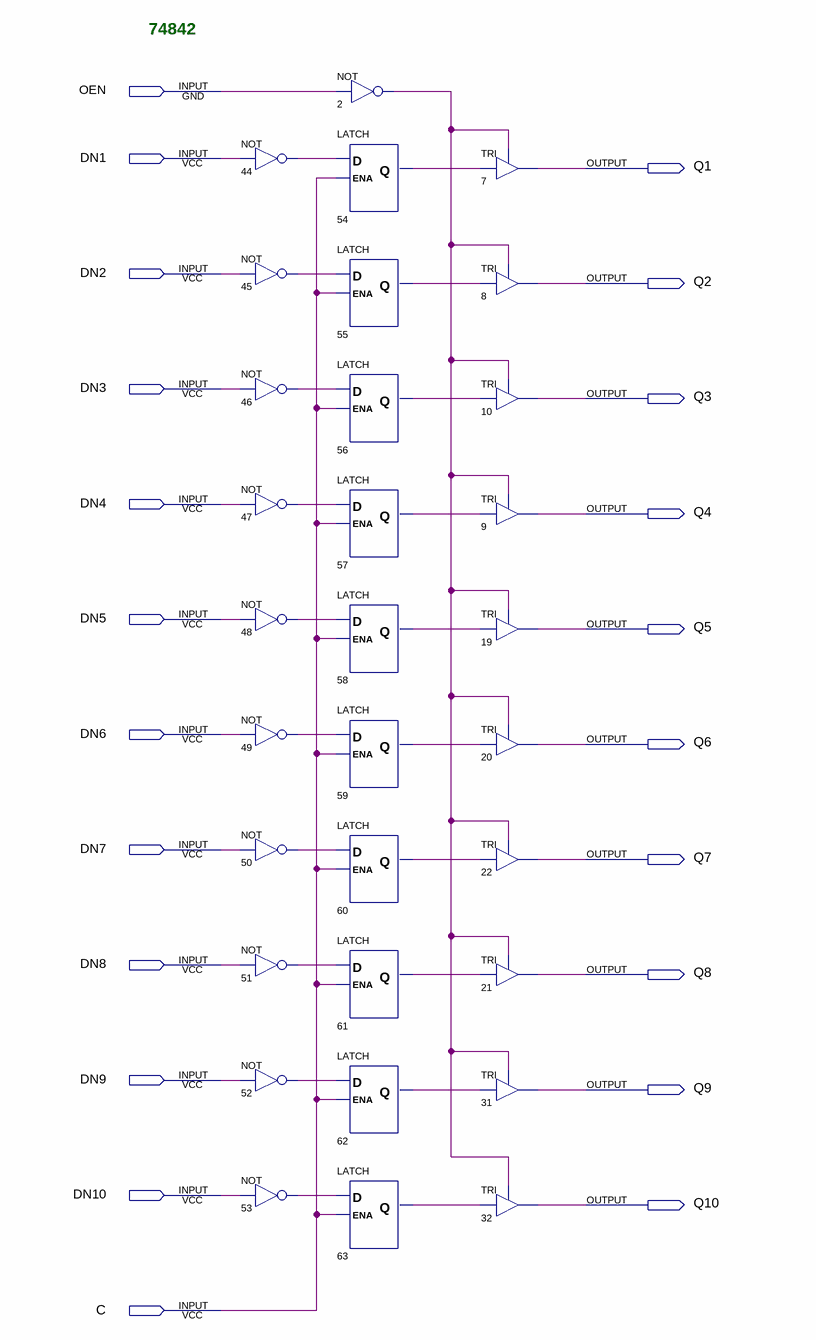
[diagram p0: schematic sheet]
// Quartus schematic 74842.bdf as structural Verilog: 31 symbols, 22 pins
module \74842  (
  input  OEN,
  input  DN1,
  input  DN2,
  input  DN3,
  input  DN4,
  input  DN5,
  input  DN6,
  input  DN7,
  input  DN8,
  input  DN9,
  input  DN10,
  input  C,
  output Q1,
  output Q2,
  output Q3,
  output Q4,
  output Q5,
  output Q6,
  output Q7,
  output Q8,
  output Q9,
  output Q10
);

  wire n2_out, n44_out, n45_out, n46_out, n47_out, n48_out, n49_out, n50_out, n51_out, n52_out, n53_out,
       n54_q, n55_q, n56_q, n57_q, n58_q, n59_q, n60_q, n61_q, n62_q, n63_q;

  not u_44 (n44_out, DN1);
  not u_45 (n45_out, DN2);
  not u_46 (n46_out, DN3);
  not u_47 (n47_out, DN4);
  not u_48 (n48_out, DN5);
  not u_49 (n49_out, DN6);
  not u_50 (n50_out, DN7);
  not u_51 (n51_out, DN8);
  not u_52 (n52_out, DN9);
  not u_53 (n53_out, DN10);
  not u_2 (n2_out, OEN);
  LATCH u_54 (.D(n44_out), .ENA(C), .Q(n54_q));
  LATCH u_55 (.D(n45_out), .ENA(C), .Q(n55_q));
  LATCH u_56 (.D(n46_out), .ENA(C), .Q(n56_q));
  LATCH u_57 (.D(n47_out), .ENA(C), .Q(n57_q));
  LATCH u_58 (.D(n48_out), .ENA(C), .Q(n58_q));
  LATCH u_59 (.D(n49_out), .ENA(C), .Q(n59_q));
  LATCH u_60 (.D(n50_out), .ENA(C), .Q(n60_q));
  LATCH u_61 (.D(n51_out), .ENA(C), .Q(n61_q));
  LATCH u_62 (.D(n52_out), .ENA(C), .Q(n62_q));
  LATCH u_63 (.D(n53_out), .ENA(C), .Q(n63_q));
  TRI u_7 (.IN(n54_q), .OE(n2_out), .OUT(Q1));
  TRI u_8 (.IN(n55_q), .OE(n2_out), .OUT(Q2));
  TRI u_10 (.IN(n56_q), .OE(n2_out), .OUT(Q3));
  TRI u_9 (.IN(n57_q), .OE(n2_out), .OUT(Q4));
  TRI u_19 (.IN(n58_q), .OE(n2_out), .OUT(Q5));
  TRI u_20 (.IN(n59_q), .OE(n2_out), .OUT(Q6));
  TRI u_22 (.IN(n60_q), .OE(n2_out), .OUT(Q7));
  TRI u_21 (.IN(n61_q), .OE(n2_out), .OUT(Q8));
  TRI u_31 (.IN(n62_q), .OE(n2_out), .OUT(Q9));
  TRI u_32 (.IN(n63_q), .OE(n2_out), .OUT(Q10));

  // Notes on the sheet:
  //   74842
endmodule
